# EAGLE design motoko_5_0 (EAGLE 9.5.2)
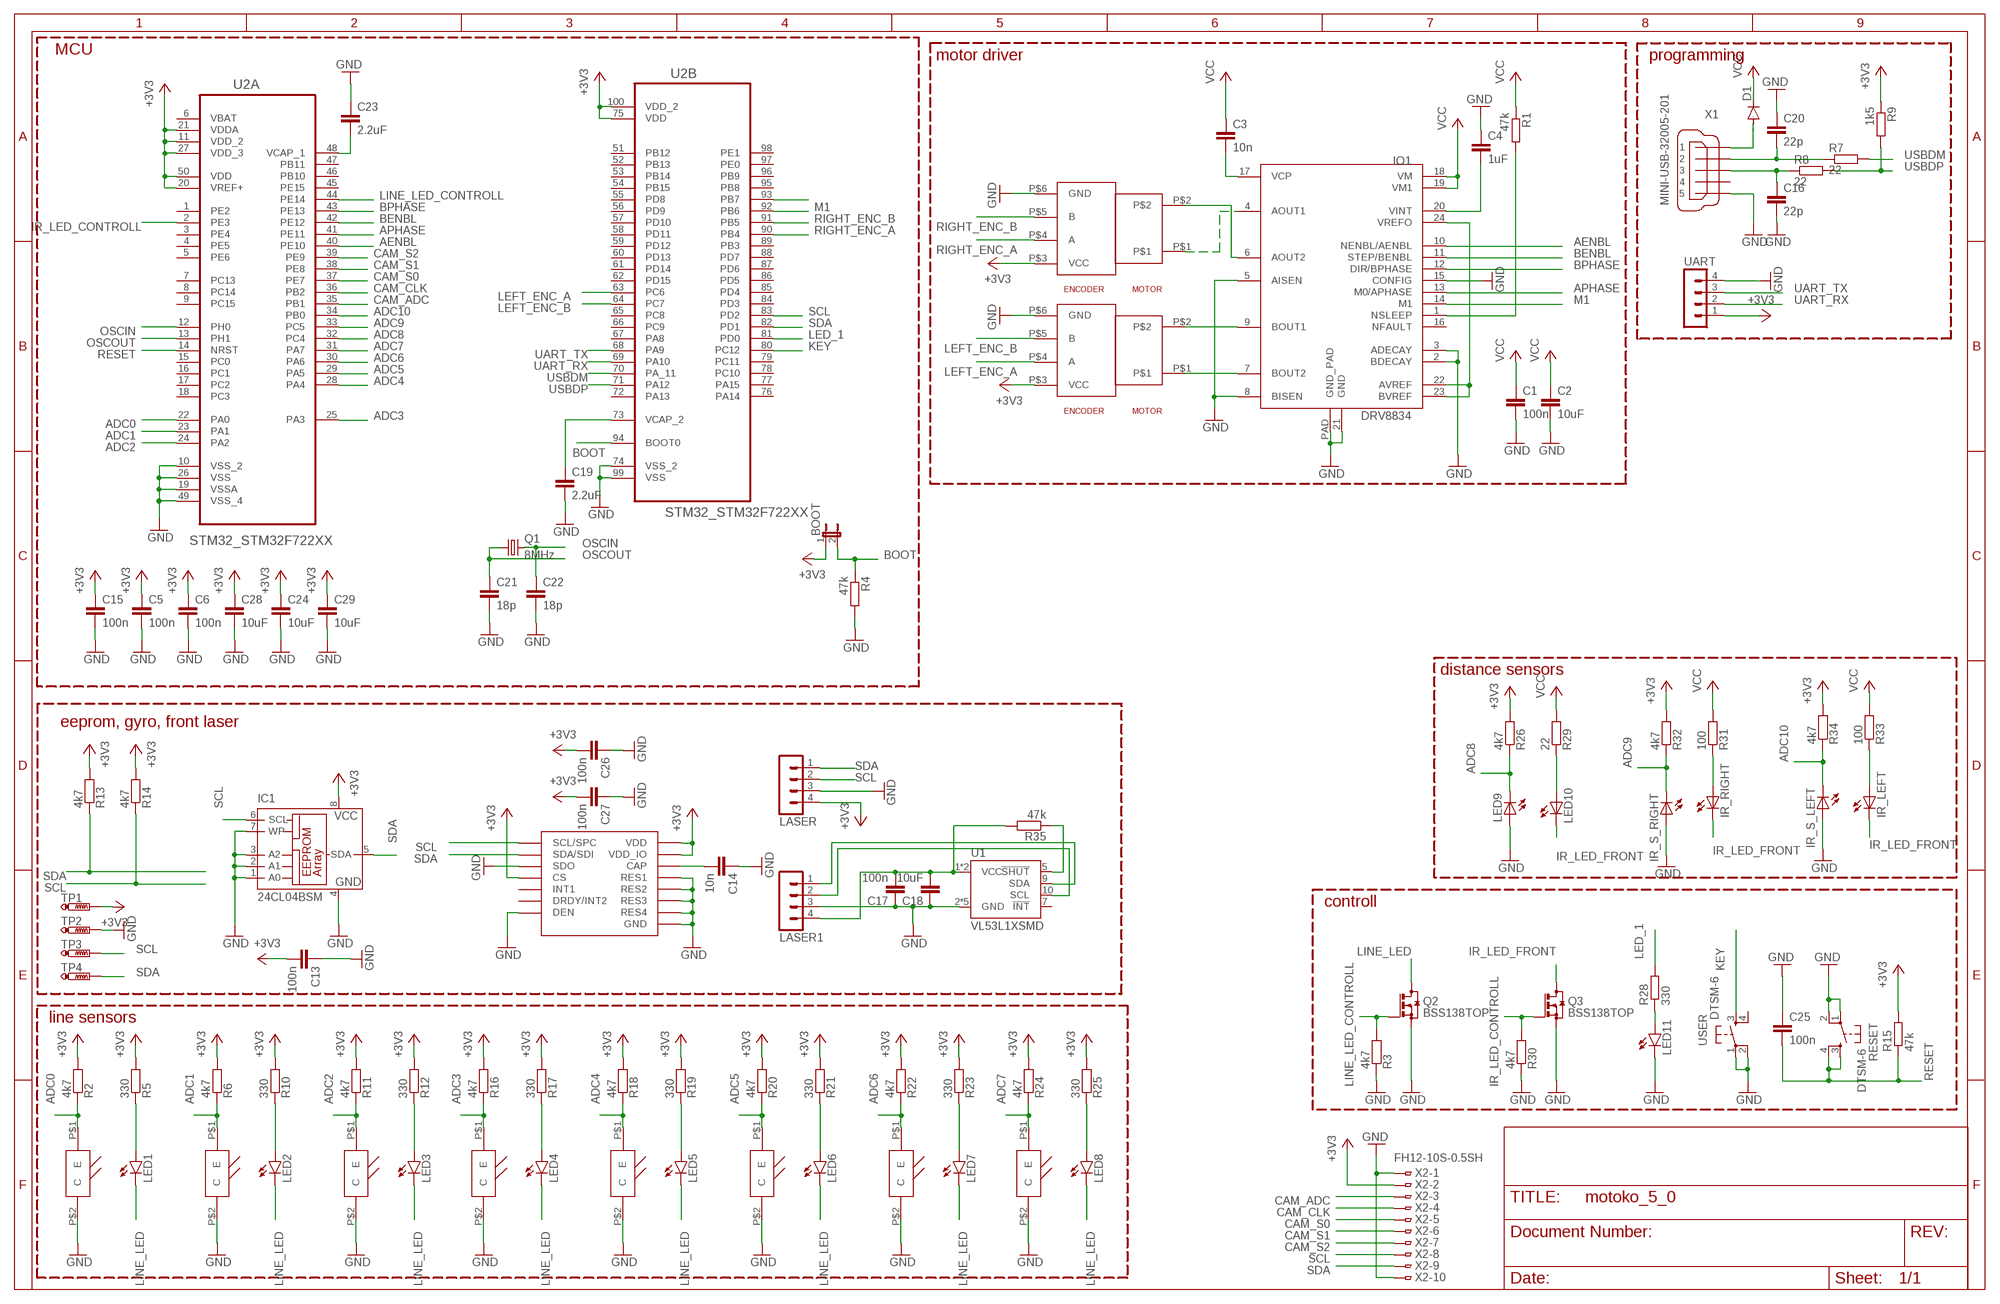
[diagram p0: schematic, sheet 1, part 1 of 2]
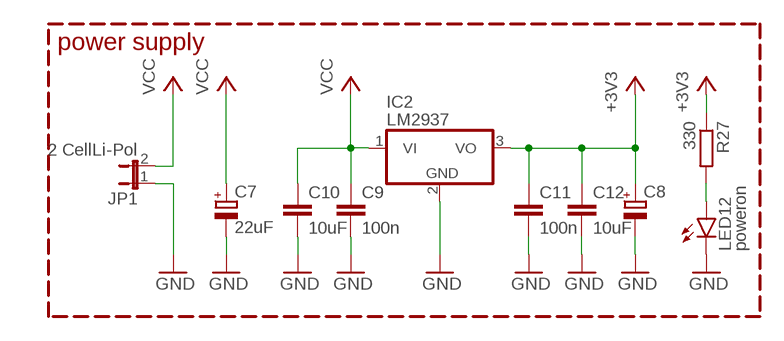
[diagram p1: schematic, sheet 1, part 2 of 2]

## Parts
BOOT  JP1E  [JP1]
C1  100n  C-EUC1206  [C1206]
C2  10uF  C-EUC1206  [C1206]
C3  10n  C-EUC1206  [C1206]
C4  1uF  C-EUC1206  [C1206]
C5  100n  C-EUC0805  [C0805]
C6  100n  C-EUC0805  [C0805]
C7  22uF  CPOL-EU153CLV-0505  [153CLV-0505]
C8  CPOL-EU140CLH-1010  [140CLH-1010]
C9  100n  C-EUC0805  [C0805]
C10  10uF  C-EUC0805  [C0805]
C11  100n  C-EUC0805  [C0805]
C12  10uF  C-EUC0805  [C0805]
C13  100n  C-EUC0805  [C0805]
C14  10n  C-EUC0805  [C0805]
C15  100n  C-EUC0805  [C0805]
C16  22p  C-EUC0805  [C0805]
C17  100n  C-EUC0805  [C0805]
C18  10uF  C-EUC0805  [C0805]
C19  2.2uF  C-EUC0805  [C0805]
C20  22p  C-EUC0805  [C0805]
C21  18p  C-EUC0805  [C0805]
C22  18p  C-EUC0805  [C0805]
C23  2.2uF  C-EUC0805  [C0805]
C24  10uF  C-EUC0805  [C0805]
C25  100n  C-EUC0805  [C0805]
C26  100n  C-EUC0805  [C0805]
C27  100n  C-EUC0805  [C0805]
C28  10uF  C-EUC0805  [C0805]
C29  10uF  C-EUC0805  [C0805]
D1  DIODE-SMB  [SMB]
IC1  24CL04BSM  [SO-08M]
IC2  LM2937  [TO263-3]
IO1  DRV8834  [DRV8834_PCK]
IR_LEFT  LED5MM  [LED5MM]
IR_RIGHT  LED5MM  [LED5MM]
IR_S_LEFT  LED5MM  [LED5MM]
IR_S_RIGHT  LED5MM  [LED5MM]
JP1  2 CellLi-Pol  JP1E  [JP1]
LASER  MA04-1  [MA04-1]
LASER1  MA04-1  [MA04-1]
LED1  LEDCHIPLED_1206  [CHIPLED_1206]
LED2  LEDCHIPLED_1206  [CHIPLED_1206]
LED3  LEDCHIPLED_1206  [CHIPLED_1206]
LED4  LEDCHIPLED_1206  [CHIPLED_1206]
LED5  LEDCHIPLED_1206  [CHIPLED_1206]
LED6  LEDCHIPLED_1206  [CHIPLED_1206]
LED7  LEDCHIPLED_1206  [CHIPLED_1206]
LED8  LEDCHIPLED_1206  [CHIPLED_1206]
LED9  LED5MM  [LED5MM]
LED10  LED5MM  [LED5MM]
LED11  LEDCHIPLED_1206  [CHIPLED_1206]
LED12  poweron  LEDCHIPLED_1206  [CHIPLED_1206]
LSM6DS0  ST_L3GD20H  [ST_LGA16L]
Q1  8MHz  CRYSTALCTS406  [CTS406]
Q2  BSS138TOP  [SOT23]
Q3  BSS138TOP  [SOT23]
R1  47k  R-EU_M1206  [M1206]
R2  4k7  R-EU_M0805  [M0805]
R3  4k7  R-EU_M0805  [M0805]
R4  47k  R-EU_M0805  [M0805]
R5  330  R-EU_M0805  [M0805]
R6  4k7  R-EU_M0805  [M0805]
R7  22  R-EU_M0805  [M0805]
R8  22  R-EU_M0805  [M0805]
R9  1k5  R-EU_M0805  [M0805]
R10  330  R-EU_M0805  [M0805]
R11  4k7  R-EU_M0805  [M0805]
R12  330  R-EU_M0805  [M0805]
R13  4k7  R-EU_M0805  [M0805]
R14  4k7  R-EU_M0805  [M0805]
R15  47k  R-EU_M0805  [M0805]
R16  4k7  R-EU_M0805  [M0805]
R17  330  R-EU_M0805  [M0805]
R18  4k7  R-EU_M0805  [M0805]
R19  330  R-EU_M0805  [M0805]
R20  4k7  R-EU_M0805  [M0805]
R21  330  R-EU_M0805  [M0805]
R22  4k7  R-EU_M0805  [M0805]
R23  330  R-EU_M0805  [M0805]
R24  4k7  R-EU_M0805  [M0805]
R25  330  R-EU_M0805  [M0805]
R26  4k7  R-EU_M0805  [M0805]
R27  330  R-EU_M0805  [M0805]
R28  330  R-EU_M0805  [M0805]
R29  22  R-EU_M0805  [M0805]
R30  4k7  R-EU_M0805  [M0805]
R31  100  R-EU_M0805  [M0805]
R32  4k7  R-EU_M0805  [M0805]
R33  100  R-EU_M0805  [M0805]
R34  4k7  R-EU_M0805  [M0805]
R35  47k  R-EU_M0805  [M0805]
RESET  DTSM-6  [DTSM-6]
TP1  PTR1B1,27  [B1,27]
TP2  PTR1B1,27  [B1,27]
TP3  PTR1B1,27  [B1,27]
TP4  PTR1B1,27  [B1,27]
U1  VL53L1XSMD  [VL53L1X]
U2  STM32_STM32F722XX  [STM32_QFP50P1600X1600X160-100N]
U$3  SFH3710  [SFH3710]
U$4  SFH3710  [SFH3710]
U$5  SFH3710  [SFH3710]
U$6  SFH3710  [SFH3710]
U$7  SFH3710  [SFH3710]
U$8  SFH3710  [SFH3710]
U$9  SFH3710  [SFH3710]
U$10  SFH3710  [SFH3710]
U$11  POLOLU_GEAR_MOTORPOLO  [POLOLU_GEAR_MOTOR]
U$12  POLOLU_GEAR_MOTORPOLO  [POLOLU_GEAR_MOTOR]
UART  MA04-1  [MA04-1]
USER  DTSM-6  [DTSM-6]
X1  MINI-USB-32005-201  [32005-201]
X2  FH12-10S-0.5SH  [FH12-10S-0.5SH]

## Nets
+3V3: BOOT.1 C5.1 C6.1 C8.+ C11.1 C12.1 C13.2 C15.1 C24.1 C26.2 C27.2 C28.1 C29.1 IC1.8(VCC) IC2.3(VO) LASER.4 LSM6DS0.P$1(VDD_IO) LSM6DS0.P$5(CS) LSM6DS0.P$16(VDD) R2.2 R5.2 R6.2 R9.1 R10.2 R11.2 R12.2 R13.2 R14.2 R15.2 R16.2 R17.2 R18.2 R19.2 R20.2 R21.2 R22.2 R23.2 R24.2 R25.2 R26.2 R27.1 R32.2 R34.2 TP1.TP U2.11(A:VDD_2) U2.20(A:VREF+) U2.21(A:VDDA) U2.27(A:VDD_3) U2.50(A:VDD) U2.75(B:VDD) U2.100(B:VDD_2) U$11.P$3(VCC) U$12.P$3(VCC) UART.1 X2.2
ADC0: R2.1 U2.22(A:PA0) U$3.P$1(E)
ADC1: R6.1 U2.23(A:PA1) U$4.P$1(E)
ADC2: R11.1 U2.24(A:PA2) U$5.P$1(E)
ADC3: R16.1 U2.25(A:PA3) U$6.P$1(E)
ADC4: R18.1 U2.28(A:PA4) U$7.P$1(E)
ADC5: R20.1 U2.29(A:PA5) U$8.P$1(E)
ADC6: R22.1 U2.30(A:PA6) U$9.P$1(E)
ADC7: R24.1 U2.31(A:PA7) U$10.P$1(E)
ADC8: LED9.K(C) R26.1 U2.32(A:PC4)
ADC9: IR_S_RIGHT.K(C) R32.1 U2.33(A:PC5)
ADC10: IR_S_LEFT.K(C) R34.1 U2.34(A:PB0)
AENBL: IO1.10(NENBL/AENBL) U2.40(A:PE10)
APHASE: IO1.13(M0/APHASE) U2.41(A:PE11)
BENBL: IO1.11(STEP/BENBL) U2.42(A:PE12)
BOOT: BOOT.2 R4.1 U2.94(B:BOOT0)
BPHASE: IO1.12(DIR/BPHASE) U2.43(A:PE13)
CAM_ADC: U2.35(A:PB1) X2.3
CAM_CLK: U2.36(A:PB2) X2.4
CAM_S0: U2.37(A:PE7) X2.5
CAM_S1: U2.38(A:PE8) X2.6
CAM_S2: U2.39(A:PE9) X2.7
GND: C1.2 C2.2 C4.1 C5.2 C6.2 C7.- C8.- C9.2 C10.2 C11.2 C12.2 C13.1 C14.1 C15.2 C16.2 C17.1 C18.1 C19.2 C20.1 C21.2 C22.2 C23.1 C24.2 C25.1 C26.1 C27.1 C28.2 C29.2 IC1.1(A0) IC1.2(A1) IC1.3(A2) IC1.4(GND) IC1.7(WP) IC2.2(GND) IO1.2(BDECAY) IO1.3(ADECAY) IO1.5(AISEN) IO1.8(BISEN) IO1.15(CONFIG) IO1.21(GND) IO1.PAD(GND_PAD) IR_S_LEFT.A IR_S_RIGHT.A JP1.1 LASER1.3 LASER.3 LED9.A LED11.C LED12.C LSM6DS0.P$4(SDO) LSM6DS0.P$8(DEN) LSM6DS0.P$9(RES1) LSM6DS0.P$10(RES2) LSM6DS0.P$11(RES3) LSM6DS0.P$12(GND) LSM6DS0.P$13(GND) LSM6DS0.P$15(RES4) Q2.2(S) Q3.2(S) R3.1 R4.2 R30.1 RESET.1 RESET.2 TP2.TP U1.2(GND) U1.3(GND) U1.4(GND) U1.6(GND) U1.12(GND) U2.10(A:VSS_2) U2.19(A:VSSA) U2.26(A:VSS) U2.49(A:VSS_4) U2.74(B:VSS_2) U2.99(B:VSS) U$3.P$2(C) U$4.P$2(C) U$5.P$2(C) U$6.P$2(C) U$7.P$2(C) U$8.P$2(C) U$9.P$2(C) U$10.P$2(C) U$11.P$6(GND) U$12.P$6(GND) UART.4 USER.1 USER.2 X1.5 X2.1 X2.10
IR_LED_CONTROLL: Q3.1(G) R30.2 U2.2(A:PE3)
IR_LED_FRONT: IR_LEFT.K(C) IR_RIGHT.K(C) LED10.K(C) Q3.3(D)
KEY: U2.80(B:PC12) USER.3
LED_1: R28.2 U2.81(B:PD0)
LEFT_ENC_A: U2.63(B:PC6) U$11.P$4(A)
LEFT_ENC_B: U2.64(B:PC7) U$11.P$5(B)
LINE_LED: LED1.C LED2.C LED3.C LED4.C LED5.C LED6.C LED7.C LED8.C Q2.3(D)
LINE_LED_CONTROLL: Q2.1(G) R3.2 U2.44(A:PE14)
M1: IO1.14(M1) U2.92(B:PB6)
N$1: IO1.6(AOUT2) U$12.P$2
N$2: IO1.4(AOUT1) U$12.P$1
N$3: IO1.7(BOUT2) U$11.P$1
N$4: IO1.9(BOUT1) U$11.P$2
N$5: C3.2 IO1.17(VCP)
N$6: C14.2 LSM6DS0.P$14(CAP)
N$7: LED10.A R29.1
N$8: IO1.22(AVREF) IO1.23(BVREF) IO1.24(VREFO)
N$9: IO1.1(NSLEEP) R1.2
N$13: IR_LEFT.A R33.1
N$14: LED1.A R5.1
N$15: LED2.A R10.1
N$16: LED3.A R12.1
N$17: LED4.A R17.1
N$18: LED5.A R19.1
N$19: LED6.A R21.1
N$20: LED7.A R23.1
N$21: LED8.A R25.1
N$22: C4.2 IO1.20(VINT)
N$23: LED12.A R27.2
N$24: IR_RIGHT.A R31.1
N$25: C19.1 U2.73(B:VCAP_2)
N$26: C17.2 C18.2 LASER1.4 R35.2 U1.1(VCC) U1.11(VCC)
N$27: LASER1.1 U1.9(SDA)
N$28: LASER1.2 U1.10(SCL)
N$29: R35.1 U1.5(!SHUT)
N$30: C23.2 U2.48(A:VCAP_1)
N$32: U2.93(B:PB7)
N$33: LED11.A R28.1
N$55: C20.2 R7.1 X1.2
N$56: C16.1 R8.1 X1.3
N$57: D1.A X1.1
OSCIN: C22.1 Q1.3 U2.12(A:PH0)
OSCOUT: C21.1 Q1.1 U2.13(A:PH1)
RESET: C25.2 R15.1 RESET.3 RESET.4 U2.14(A:NRST)
RIGHT_ENC_A: U2.90(B:PB4) U$12.P$4(A)
RIGHT_ENC_B: U2.91(B:PB5) U$12.P$5(B)
SCL: IC1.6(SCL) LASER.2 LSM6DS0.P$2(SCL/SPC) R14.1 TP3.TP U2.83(B:PD2) X2.8
SDA: IC1.5(SDA) LASER.1 LSM6DS0.P$3(SDA/SDI) R13.1 TP4.TP U2.82(B:PD1) X2.9
UART_RX: U2.69(B:PA10) UART.2
UART_TX: U2.68(B:PA9) UART.3
USBDM: R7.2 U2.70(B:PA_11)
USBDP: R8.2 R9.2 U2.71(B:PA12)
VCC: C1.1 C2.1 C3.1 C7.+ C9.1 C10.1 D1.C IC2.1(VI) IO1.18(VM) IO1.19(VM1) JP1.2 R1.1 R29.2 R31.2 R33.2
Unconnected: IO1.16(NFAULT) LSM6DS0.P$6(DRDY/INT2) LSM6DS0.P$7(INT1) U1.7(!INT) U2.1(A:PE2) U2.3(A:PE4) U2.4(A:PE5) U2.5(A:PE6) U2.7(A:PC13) U2.8(A:PC14) U2.9(A:PC15) U2.15(A:PC0) U2.16(A:PC1) U2.17(A:PC2) U2.18(A:PC3) U2.45(A:PE15) U2.46(A:PB10) U2.47(A:PB11) U2.51(B:PB12) U2.52(B:PB13) U2.53(B:PB14) U2.54(B:PB15) U2.55(B:PD8) U2.56(B:PD9) U2.57(B:PD10) U2.58(B:PD11) U2.59(B:PD12) U2.60(B:PD13) U2.61(B:PD14) U2.62(B:PD15) U2.65(B:PC8) U2.66(B:PC9) U2.67(B:PA8) U2.72(B:PA13) U2.76(B:PA14) U2.77(B:PA15) U2.78(B:PC10) U2.79(B:PC11) U2.84(B:PD3) U2.85(B:PD4) U2.86(B:PD5) U2.87(B:PD6) U2.88(B:PD7) U2.89(B:PB3) U2.95(B:PB8) U2.96(B:PB9) U2.97(B:PE0) U2.98(B:PE1) USER.4 X1.4

## Notes on the sheet
- MCU
- motor driver | programming
- power supply
- distance sensors
- eeprom, gyro, front laser
- controll
- line sensors

## Power pins joined to a net without a drawn wire
VBAT: U2.6(A:VBAT)

## Library data of the parts
BOOT JP1 = jumper:JP1E: JUMPER
C1-C6 C9-C29 = resistor:C-EU: CAPACITOR, European symbol
C7 = resistor:CPOL-EU: POLARIZED CAPACITOR, European symbol
C8 = rcl:CPOL-EU: POLARIZED CAPACITOR, European symbol; SPICEPREFIX: C
D1 = diode:DIODE-: DIODE
IC1 = microchip:24*: Serial EEPROM I2C; MPN: FM24CL04-S; OC_FARNELL: 1607928; OC_NEWARK: 97H6443
IC2 = linear:LM2937: LM2937-2.5, LM2937-3.3 400mA and 500mA Voltage Regulators Source: http://cache.national.com/ds/LM/LM2937-2.5.pdf
IO1 = yellow_car:DRV8834
IR_LEFT IR_RIGHT IR_S_LEFT IR_S_RIGHT LED9 LED10 = my_parts:LED: LED OSRAM: - CHIPLED LG R971, LG N971, LY N971, LG Q971, LY Q971, LO R971, LY R971 LH N974, LH R974 LS Q976, LO Q976, LY Q976 LO Q996 - Hyper CHIPLED LW Q18S LB Q993, LB Q99A, LB R99A - SideLED LS A670, LO A670, LY A670, LG A670, LP A670 LB A673, LV A673, LT A673, LW A673 LH A674 LY A675 LS A676, LA A676, LO A676, LY A676, LW A676 LS A679, LY A679, LG A679 - Hyper Micro SIDELED® LS Y876, LA Y876, LO Y876, LY Y876 LT Y87S - SmartLED LW L88C, LW L88S LB L89C, LB L89S, LG L890 LS L89K, LO L89K, LY L89K LS L896, LA L896, LO L896, LY L896 - TOPLED LS T670, LO T670, LY T670, LG T670, LP T670 LSG T670, LSP T670, LSY T670, LOP T670, LYG T670 LG T671, LOG T671, LSG T671 LB T673, LV T673, LT T673, LW T673 LH T674 LS T676, LA T676, LO T676, LY T676, LB T676, LH T676, LSB T676, LW T676 LB T67C, LV T67C, LT T67C, LS T67K, LO T67K, LY T67K, LW E67C LS E67B, LA E67B, LO E67B, LY E67B, LB E67C, LV E67C, LT E67C LW T67C LS T679, LY T679, LG T679 LS T770, LO T770, LY T770, LG T770, LP T770 LB T773, LV T773, LT T773, LW T773 LH T774 LS E675, LA E675, LY E675, LS T675 LS T776, LA T776, LO T776, LY T776, LB T776 LHGB T686 LT T68C, LB T68C - Hyper Mini TOPLED® LB M676 - Mini TOPLED Santana® LG M470 LS M47K, LO M47K, LY M47K Source: http://www.osram.convergy.de LUXEON: - LUMILED® LXK2-PW12-R00, LXK2-PW12-S00, LXK2-PW14-U00, LXK2-PW14-V00 LXK2-PM12-R00, LXK2-PM12-S00, LXK2-PM14-U00 LXK2-PE12-Q00, LXK2-PE12-R00, LXK2-PE12-S00, LXK2-PE14-T00, LXK2-PE14-U00 LXK2-PB12-K00, LXK2-PB12-L00, LXK2-PB12-M00, LXK2-PB14-N00, LXK2-PB14-P00, LXK2-PB14-Q00 LXK2-PR12-L00, LXK2-PR12-M00, LXK2-PR14-Q00, LXK2-PR14-R00 LXK2-PD12-Q00, LXK2-PD12-R00, LXK2-PD12-S00 LXK2-PH12-R00, LXK2-PH12-S00 LXK2-PL12-P00, LXK2-PL12-Q00, LXK2-PL12-R00 Source: www.luxeon.com KINGBRIGHT: KA-3528ASYC Source: www.kingbright.com
LASER LASER1 UART = con-lstb:MA04-1: PIN HEADER; OC_FARNELL: unknown; OC_NEWARK: unknown
LED1-LED8 LED11 LED12 = led:LED: LED OSRAM: - CHIPLED LG R971, LG N971, LY N971, LG Q971, LY Q971, LO R971, LY R971 LH N974, LH R974 LS Q976, LO Q976, LY Q976 LO Q996 - Hyper CHIPLED LW Q18S LB Q993, LB Q99A, LB R99A - SideLED LS A670, LO A670, LY A670, LG A670, LP A670 LB A673, LV A673, LT A673, LW A673 LH A674 LY A675 LS A676, LA A676, LO A676, LY A676, LW A676 LS A679, LY A679, LG A679 - Hyper Micro SIDELED® LS Y876, LA Y876, LO Y876, LY Y876 LT Y87S - SmartLED LW L88C, LW L88S LB L89C, LB L89S, LG L890 LS L89K, LO L89K, LY L89K LS L896, LA L896, LO L896, LY L896 - TOPLED LS T670, LO T670, LY T670, LG T670, LP T670 LSG T670, LSP T670, LSY T670, LOP T670, LYG T670 LG T671, LOG T671, LSG T671 LB T673, LV T673, LT T673, LW T673 LH T674 LS T676, LA T676, LO T676, LY T676, LB T676, LH T676, LSB T676, LW T676 LB T67C, LV T67C, LT T67C, LS T67K, LO T67K, LY T67K, LW E67C LS E67B, LA E67B, LO E67B, LY E67B, LB E67C, LV E67C, LT E67C LW T67C LS T679, LY T679, LG T679 LS T770, LO T770, LY T770, LG T770, LP T770 LB T773, LV T773, LT T773, LW T773 LH T774 LS E675, LA E675, LY E675, LS T675 LS T776, LA T776, LO T776, LY T776, LB T776 LHGB T686 LT T68C, LB T68C - Hyper Mini TOPLED® LB M676 - Mini TOPLED Santana® LG M470 LS M47K, LO M47K, LY M47K Source: http://www.osram.convergy.de LUXEON: - LUMILED® LXK2-PW12-R00, LXK2-PW12-S00, LXK2-PW14-U00, LXK2-PW14-V00 LXK2-PM12-R00, LXK2-PM12-S00, LXK2-PM14-U00 LXK2-PE12-Q00, LXK2-PE12-R00, LXK2-PE12-S00, LXK2-PE14-T00, LXK2-PE14-U00 LXK2-PB12-K00, LXK2-PB12-L00, LXK2-PB12-M00, LXK2-PB14-N00, LXK2-PB14-P00, LXK2-PB14-Q00 LXK2-PR12-L00, LXK2-PR12-M00, LXK2-PR14-Q00, LXK2-PR14-R00 LXK2-PD12-Q00, LXK2-PD12-R00, LXK2-PD12-S00 LXK2-PH12-R00, LXK2-PH12-S00 LXK2-PL12-P00, LXK2-PL12-Q00, LXK2-PL12-R00 Source: www.luxeon.com KINGBRIGHT: KA-3528ASYC Source: www.kingbright.com
LSM6DS0 = motoko_5_0:ST_L3GD20H
Q1 = crystal:CRYSTAL: CRYSTAL; OC_FARNELL: unknown; OC_NEWARK: unknown
Q2 Q3 = JCM:BSS138
R1-R35 = resistor:R-EU_: RESISTOR, European symbol
RESET USER = switch-tact:DTSM-6
TP1-TP4 = testpad:PTR1: TEST PIN
U1 = SparkFun-Sensors:VL53L1X: STMicroelectronics VL53L1X - 400 cm IR Laser ToF Sensor VL53L1X is a state-of-the-art ToF laser-ranging sensor, enhancing the ST FlightSense product family. It is the fastest miniature ToF sensor currently on the market with accurate ranging up to 4 m and fast ranging frequency (up to 50 Hz). Housed in a miniature and reflowable package, it integrates a single photon avalanche diode (SPAD) receiving array, a 940 nm invisible laser Class 1 emitter, physical infrared filters, and optics to achieve the best ranging performance in various ambient lighting conditions with a range of cover window options.; PROD_ID: IC-13960
U2 = ascender_board:STM32_STM32F722XX: IC, MCU, 32BIT, 512K FLASH, 100LQFP; MPN: STM32F407VET6; OC_FARNELL: 2064367; OC_NEWARK: 73T2332; PACKAGE: 100LQFP; SUPPLIER: STMicroelectronics
U$3-U$10 = my_parts:SFH3710
U$11 U$12 = my_parts:POLOLU_GEAR_MOTOR
X1 = con-cypressindustries:MINI-USB-: MINI USB-B Conector Source: www.cypressindustries.com; OC_FARNELL: unknown; OC_NEWARK: unknown
X2 = con-hirose:FH12-10S-0.5S: 0.5mm Pitch Connectors For FPC/FFC Source: Data sheet <http://www.hirose.co.jp/cataloge_hp/e58605370.pdf>; MPN: FH12-10S-0.5SH(55); OC_FARNELL: 1324540; OC_NEWARK: 34M6152

## Board
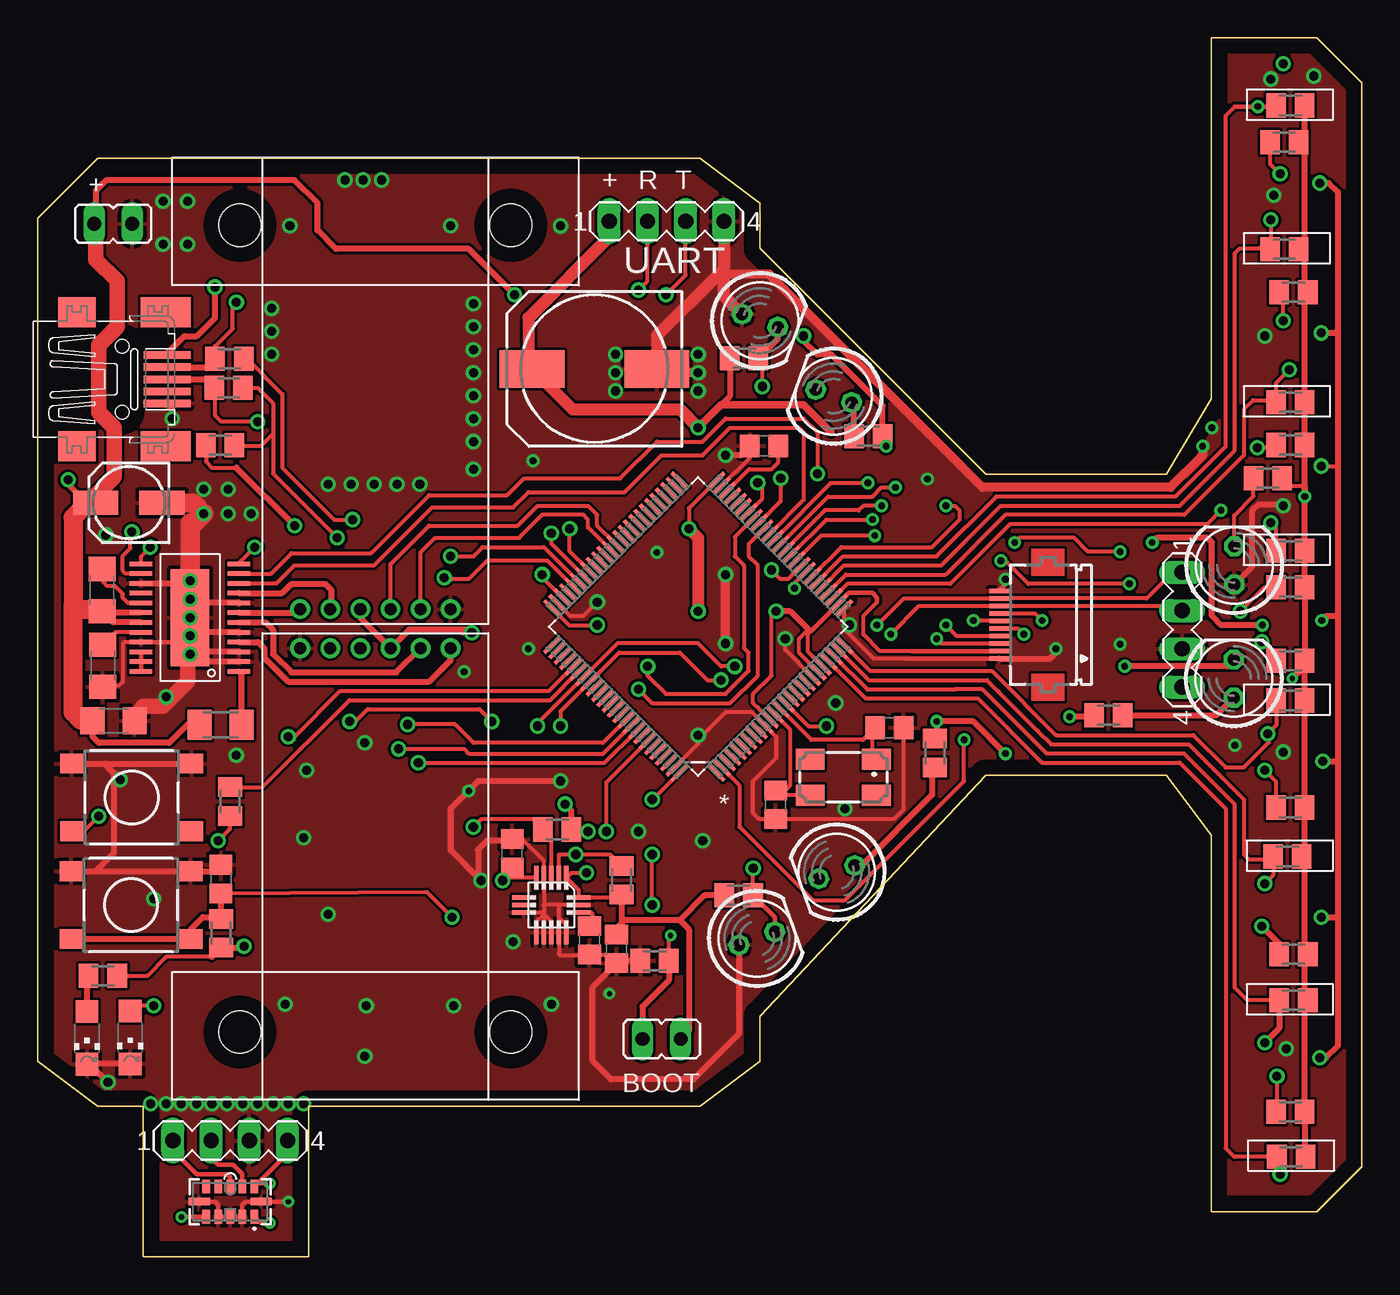
[diagram p2: board, top side]
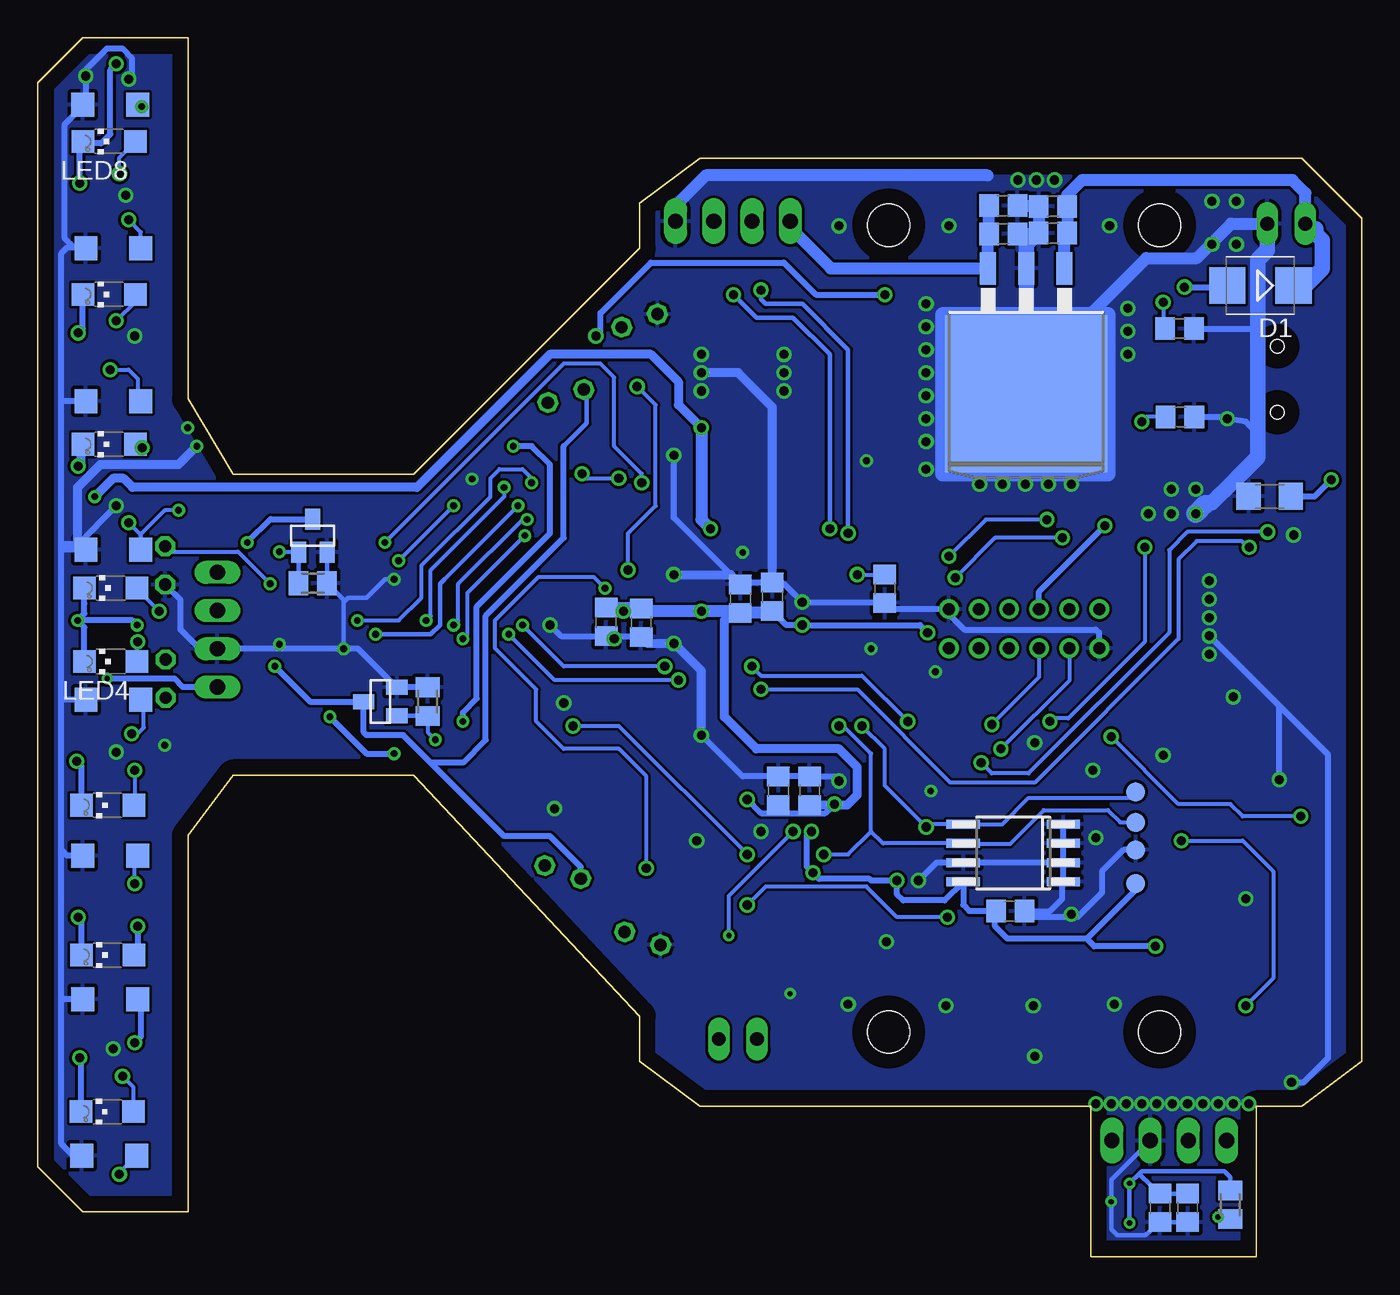
[diagram p3: board, bottom side, seen from below]

Size 88 x 81 mm. Coordinates in mm from the lower left corner, seen from the top.
Outline: 85,81 78,81 78,57 75,52 63,52 48,67 48,70 44,73 4,73 0,69 0,13 4,10 7,10 7,0 18,0 18,10 44,10 48,13 48,16 63,32 75,32 78,28 78,3 85,3 88,6 88,78 85,81
Copper layers (1*16): Top 0.035mm / dielectric 1.5mm / Bottom 0.035mm
Design rules "default *": minimum track width 8mil, minimum drill 24mil, track to track 7mil, track to pad 7mil, pad to pad 7mil, via to via 7mil, smd to smd 7mil, copper to edge 40mil, drill to drill 8mil, minimum pad ring 10mil, minimum via ring 8mil, stop-mask expansion 4mil, vias tented up to drill 30mil, thermal gap 10mil

### Footprints (pad centres in the part's own frame; a part is rotated, then mirrored left to right if it is on the bottom)
JP1 = drill 0.914 long: 1 0,-1.27; 2 0,1.27
C1206 = smd 1.6 x 1.8: 1 -1.4,0; 2 1.4,0
C0805 = smd 1.3 x 1.5: 1 -0.95,0; 2 0.95,0
153CLV-0505 = smd 3 x 1.6: + 2.2,0; - -2.2,0
140CLH-1010 = smd 4.3 x 2.5: + 4.15,0; - -4.15,0
SMB = smd 2.4 x 2.4: A 2.2,0; C -2.2,0
SO-08M = smd 0.6 x 2.2: 1 -1.905,-3.33; 2 -0.635,-3.33; 3 0.635,-3.33; 4 1.905,-3.33; 5 1.905,3.33; 6 0.635,3.33; 7 -0.635,3.33; 8 -1.905,3.33
TO263-3 = smd 1.067 x 2.159: 1 -2.54,-5.791; 2 0,-5.791; 3 2.54,-5.791 | smd 10.8 x 10.41: TAB 0,2.54
DRV8834_PCK = smd 0.3 x 1.5: 1 -3.575,-3.25; 2 -2.925,-3.25; 3 -2.275,-3.25; 4 -1.625,-3.25; 5 -0.975,-3.25; 6 -0.325,-3.25; 7 0.325,-3.25; 8 0.975,-3.25; 9 1.625,-3.25; 10 2.275,-3.25; 11 2.925,-3.25; 12 3.575,-3.25; 13 3.575,3.25; 14 2.925,3.25; 15 2.275,3.25; 16 1.625,3.25; 17 0.975,3.25; 18 0.325,3.25; 19 -0.325,3.25; 20 -0.975,3.25; 21 -1.625,3.25; 22 -2.275,3.25; 23 -2.925,3.25; 24 -3.575,3.25 | smd 6.452 x 2.54: PAD 0,0
LED5MM = drill 0.813 octagon: A -1.27,0; K 1.27,0
MA04-1 = drill 1.016 long: 1 -3.81,0; 2 -1.27,0; 3 1.27,0; 4 3.81,0
CHIPLED_1206 = smd 1.5 x 1.5: A 0,-1.75; C 0,1.75
ST_LGA16L = smd 1.6 x 0.3: P$1 -1.8,1; P$2 -1.8,0.5; P$3 -1.8,0; P$4 -1.8,-0.5; P$5 -1.8,-1; P$9 1.8,-1; P$10 1.8,-0.5; P$11 1.8,0; P$12 1.8,0.5; P$13 1.8,1 | smd 0.3 x 1.6: P$6 -0.5,-1.8; P$7 0,-1.8; P$8 0.5,-1.8; P$14 0.5,1.8; P$15 0,1.8; P$16 -0.5,1.8
CTS406 = smd 1.9 x 1.4: 1 -2.2,-1.2; 2 2.2,-1.2; 3 2.2,1.2; 4 -2.2,1.2
SOT23 = smd 1 x 1.4: 1 -0.95,-1.1; 2 0.95,-1.1; 3 0,1.1
M1206 = smd 1.6 x 2: 1 -1.4,0; 2 1.4,0
M0805 = smd 1.3 x 1.6: 1 -0.95,0; 2 0.95,0
DTSM-6 = smd 1.55 x 1.3: 1 -3.975,2.25; 2 3.975,2.25; 3 -3.975,-2.25; 4 3.975,-2.25
B1,27 = smd 1.27 x 1.27: TP 0,0
VL53L1X = smd 0.5 x 0.9: 1 1.6,-1; 2 0.8,-1; 3 0,-1; 4 -0.8,-1; 5 -1.6,-1; 7 -1.6,1; 8 -0.8,1; 9 0,1; 10 0.8,1; 11 1.6,1 | smd 1.4 x 0.5: 6 -2.05,0; 12 2.05,0
STM32_QFP50P1600X1600X160-100N = smd 1.473 x 0.254: 1 -7.722,5.994; 2 -7.722,5.512; 3 -7.722,5.004; 4 -7.722,4.496; 5 -7.722,3.988; 6 -7.722,3.505; 7 -7.722,2.997; 8 -7.722,2.489; 9 -7.722,2.007; 10 -7.722,1.499; 11 -7.722,0.991; 12 -7.722,0.508; 13 -7.722,0; 14 -7.722,-0.508; 15 -7.722,-0.991; 16 -7.722,-1.499; 17 -7.722,-2.007; 18 -7.722,-2.489; 19 -7.722,-2.997; 20 -7.722,-3.505; 21 -7.722,-3.988; 22 -7.722,-4.496; 23 -7.722,-5.004; 24 -7.722,-5.512; 25 -7.722,-5.994; 51 7.722,-5.994; 52 7.722,-5.512; 53 7.722,-5.004; 54 7.722,-4.496; 55 7.722,-3.988; 56 7.722,-3.505; 57 7.722,-2.997; 58 7.722,-2.489; 59 7.722,-2.007; 60 7.722,-1.499; 61 7.722,-0.991; 62 7.722,-0.508; 63 7.722,0; 64 7.722,0.508; 65 7.722,0.991; 66 7.722,1.499; 67 7.722,2.007; 68 7.722,2.489; 69 7.722,2.997; 70 7.722,3.505; 71 7.722,3.988; 72 7.722,4.496; 73 7.722,5.004; 74 7.722,5.512; 75 7.722,5.994 | smd 0.254 x 1.473: 26 -5.994,-7.722; 27 -5.512,-7.722; 28 -5.004,-7.722; 29 -4.496,-7.722; 30 -3.988,-7.722; 31 -3.505,-7.722; 32 -2.997,-7.722; 33 -2.489,-7.722; 34 -2.007,-7.722; 35 -1.499,-7.722; 36 -0.991,-7.722; 37 -0.508,-7.722; 38 0,-7.722; 39 0.508,-7.722; 40 0.991,-7.722; 41 1.499,-7.722; 42 2.007,-7.722; 43 2.489,-7.722; 44 2.997,-7.722; 45 3.505,-7.722; 46 3.988,-7.722; 47 4.496,-7.722; 48 5.004,-7.722; 49 5.512,-7.722; 50 5.994,-7.722; 76 5.994,7.722; 77 5.512,7.722; 78 5.004,7.722; 79 4.496,7.722; 80 3.988,7.722; 81 3.505,7.722; 82 2.997,7.722; 83 2.489,7.722; 84 2.007,7.722; 85 1.499,7.722; 86 0.991,7.722; 87 0.508,7.722; 88 0,7.722; 89 -0.508,7.722; 90 -0.991,7.722; 91 -1.499,7.722; 92 -2.007,7.722; 93 -2.489,7.722; 94 -2.997,7.722; 95 -3.505,7.722; 96 -3.988,7.722; 97 -4.496,7.722; 98 -5.004,7.722; 99 -5.512,7.722; 100 -5.994,7.722
SFH3710 = smd 1.52 x 1.6: P$1 -1.75,0; P$2 1.9,0
POLOLU_GEAR_MOTOR = drill 0.8: P$1 -5,-14.5; P$2 -3,-14.5; P$3 -1,-14.5; P$4 1,-14.5; P$5 3,-14.5; P$6 5,-14.5 | hole 2.8: -9,11; 9,11
32005-201 = smd 3.1 x 0.5: 1 3,1.6; 2 3,0.8; 3 3,0; 4 3,-0.8; 5 3,-1.6 | smd 2.5 x 2: M1 -3,-4.45; M2 -3,4.45 | smd 3.3 x 2: M3 2.9,4.45; M4 2.9,-4.45 | hole 0.9: 0,2.2; 0,-2.2
FH12-10S-0.5SH = smd 0.3 x 1.3: 1 -2.25,3.25; 2 -1.75,3.25; 3 -1.25,3.25; 4 -0.75,3.25; 5 -0.25,3.25; 6 0.25,3.25; 7 0.75,3.25; 8 1.25,3.25; 9 1.75,3.25; 10 2.25,3.25

### Placement (x,y rotation side)
BOOT  41.46,14.48 90 top
C1  6.13,50.52 180 bottom
C2  5.05,35.62 0 top
C3  4.29,44.3 90 top
C4  4.34,39.27 90 top
C5  50.22,42.19 270 bottom
C6  38.78,30.97 90 bottom
C7  6.06,50.09 180 top
C8  37,59 180 top
C9  20.53,68.02 180 bottom
C10  20.53,69.79 180 bottom
C11  23.83,69.84 0 bottom
C12  23.83,67.96 0 bottom
C13  23.37,22.98 180 bottom
C14  36.68,21.05 90 top
C15  39.17,43.85 90 bottom
C16  12.08,55.8 0 bottom
C17  13.41,3.27 90 bottom
C18  11.58,3.27 90 bottom
C19  31.7,44.39 270 bottom
C20  12.12,61.68 180 bottom
C21  56.59,35.16 0 top
C22  49.04,30.04 270 top
C23  48.27,53.88 0 top
C24  47.89,42.14 270 bottom
C25  12.19,25.11 270 top
C26  38.47,20.47 90 top
C27  31.53,26.81 270 top
C28  36.7,30.98 90 bottom
C29  41.3,43.73 90 bottom
D1  6.74,64.53 180 bottom
IC1  23.16,26.84 90 bottom
IC2  22.31,59.89 180 bottom
IO1  10.13,42.47 90 top
IR_LEFT  53.1,25.57 200 top
IR_RIGHT  52.9,57.18 160 top
IR_S_LEFT  48,62.2 340 top
IR_S_RIGHT  47.8,21.16 20 top
JP1  5.02,68.64 90 top
LASER  76.06,41.67 270 top
LASER1  12.8,7.74 0 top
LED1  83.37,9.65 90 bottom
LED2  83.35,20.05 90 bottom
LED3  83.35,30.01 90 bottom
LED4  83.14,39.56 90 bottom
LED5  83.14,44.44 90 bottom
LED6  83.25,53.99 90 bottom
LED7  83.25,63.94 90 bottom
LED8  83.25,74.1 90 bottom
LED9  79.52,45.94 90 top
LED10  79.49,38.42 90 top
LED11  6.15,14.58 180 top
LED12  3.28,14.55 180 top
LSM6DS0  34.14,23.38 270 top
Q1  53.54,31.87 180 top
Q2  69.72,47.92 0 bottom
Q3  65.23,36.9 90 bottom
R1  12.16,35.36 0 top
R2  83.3,6.65 0 top
R3  69.72,44.75 180 bottom
R4  41,19.68 180 top
R5  83.25,9.64 0 top
R6  83.46,17.06 0 top
R7  12.75,59.66 0 top
R8  12.7,57.73 0 top
R9  12.14,53.91 0 top
R10  83.46,20.1 0 top
R11  83.05,26.61 0 top
R12  83.25,29.86 0 top
R13  34.52,28.4 0 top
R14  38.8,25.03 270 top
R15  12.2,21.51 270 top
R16  83.25,36.97 0 top
R17  83.25,39.61 0 top
R18  83.25,46.93 0 top
R19  83.25,44.49 0 top
R20  83.25,56.78 0 top
R21  83.25,53.94 0 top
R22  82.85,66.94 0 top
R23  83.46,64.1 0 top
R24  83.25,76.49 0 top
R25  82.85,74.05 0 top
R26  81.75,51.73 0 top
R27  4.34,18.69 180 top
R28  12.78,30.26 90 top
R29  71.16,35.98 180 top
R30  62.08,36.9 270 bottom
R31  55.2,54.53 0 top
R32  46.59,24.02 180 top
R33  59.62,33.48 90 top
R34  46.94,59.71 180 top
R35  8.74,3.47 90 bottom
RESET  6.2,23.38 0 top
TP1  15.04,24.81 0 bottom
TP2  15.04,27.04 0 bottom
TP3  15.04,28.87 0 bottom
TP4  15.04,30.9 0 bottom
U1  12.8,3.67 0 top
U2  43.89,41.88 135 top
U$3  83.17,6.73 180 bottom
U$4  83.09,17.11 180 bottom
U$5  83.09,26.66 180 bottom
U$6  82.89,37.03 180 bottom
U$7  82.89,46.98 180 bottom
U$8  82.89,56.84 180 bottom
U$9  82.89,67 180 bottom
U$10  83.09,76.55 180 bottom
U$11  22.45,57.54 0 top
U$12  22.45,25.94 180 top
UART  41.8,68.8 0 top
USER  6.25,30.53 0 top
X1  5.61,58.31 0 top
X2  67.13,42 90 top

### Tracks (layer width: path | path; a pad name or v marks a point on that pad's centre or on a via)
+3V3  (via drill 0.35, 0.45, 0.6, 0.61)
  Top 0.254: R27.1 7.3,18.69 8.53,19.93 11.57,19.93 | R9.1 11.19,52.84 11.58,52.44 13.21,52.44 | R25.2 83.93,74.05 84.2,73.78 | R24.2 84.2,76.23 84.19,76.22 | 82.7,51.22 84.2,51.22 | LSM6DS0.P$1 35.14,24.99 | U2.100 40.89,30.39 v40.84,30.39 | U2.75 35.31,41.98 v37.19,41.98 | U2.50 43.28,49.74 v43.28,48.38 | U2.21 51.21,40.2 51.21,41.4 51.34,41.53 51.5,41.69 | 51.5,41.69 U2.27 | U2.20 50.6,40.13 50.6,41.06 51.22,41.69 51.5,41.69 | 58.12,40.25 55.98,40.25 54.86,41.37 54.86,42.59 55.78,43.5 | U2.11 48.02,36.35 | 48.02,36.35 47.88,36.49 47.85,36.49 | 48.02,36.35 47.99,36.35 47.55,36.8 47.55,37.41 48.77,38.62 48.77,42.59 v49.07,42.89 | LSM6DS0.P$1 35.94,24.38 LSM6DS0.P$16 38.6,23.88 R14.2 | LSM6DS0.P$1 35.47,25.52 v36.47,25.52 | R13.2 35.61,28.26 | LSM6DS0.P$5 31.06,25.18 v30.89,25.01 30.95,24.94
  Top 0.305: 38.51,21.55 C26.2 | X2.2 58.12,40.25 | 55.78,43.5 55.78,43.81 55.47,44.11 53.92,44.11 51.34,41.53 | 82.7,51.22 R26.2
  Top 0.406: U$11.P$3 21.45,42.44 U$12.P$3 24.68,41.67 28.04,41.67 | 28.45,41.67 28.04,41.67 | v17.07,48.58 13.21,52.44 | v28.85,41.47 28.25,41.47 28.04,41.67 | R2.2 84.25,9.6 R5.2 84.2,17.09 | 84.2,17.09 84.2,19.73 | 84.2,19.73 84.2,26.64 | 84.2,26.64 R12.2 R16.2 R17.2 | v84.2,50.51 R18.2 R19.2 R17.2 | 84.2,51.22 v84.2,50.51 | v84.2,50.51 R21.2 R20.2 84.2,64.63 | R11.2 84.17,26.61 84.2,26.64 | R10.2 84.41,19.93 84.2,19.73 | R6.2 84.23,17.06 84.2,17.09 | 84.2,64.63 84.2,67.07 | 84.2,67.07 84.2,73.78 R24.2 83.99,76.71 | R22.2 84.07,66.94 84.2,67.07 | R23.2 84.41,64.43 84.2,64.63 | 84.19,76.22 84.19,76.83 | R13.2 35.47,29.67 v35.05,30.09 | 39.09,24.2 R14.2 38.8,21.85 38.51,21.55 | C26.2 38.2,21.38 38.2,21.55 39.01,22.37 42.67,22.37 | v83.38,38.42 84.2,39.25 R17.2 | 42.67,22.37 43.28,21.76 43.28,15.02 BOOT.1 | R32.2 44.32,24.02 42.67,22.37 | R34.2 45.99,57.19 v43.89,55.08 | 51.22,41.69 50.02,42.89 v49.07,42.89 | 11.57,19.93 R15.2 13.63,20.56 v13.72,20.64 | 35.61,28.26 v36.58,28.26 | C27.2 30.89,25.21 v30.89,25.01
  Top 0.508: v43.89,55.08 45.41,56.61 50.9,56.61 52.73,54.78
  Top 0.813: UART.1 37.98,67.77 32.61,62.4 32.61,59.24 C8.+ 35.55,56.3 42.67,56.3 v43.89,55.08 | v43.28,48.38 43.89,47.77 v43.89,42.89
  Bottom 0.254: C6.1 38.77,29.55 38.71,29.48 | C28.1 36.7,29.9 36.27,29.48
  Bottom 0.406: U$11.P$3 21.45,44.2 v17.07,48.58 | TP1.TP 15.04,24.4 18.29,21.15 | 18.29,21.15 23.57,21.15 24.38,21.96 24.38,22.81 C13.2 26.09,22.98 26.5,23.38 IC1.8 27.74,23.69 30.48,23.69 30.89,24.09 v30.89,25.01 32.61,25.01 32.71,25.11 36.07,25.11 v36.47,25.52 36.88,25.92 36.88,27.96 v36.58,28.26 | LASER.4 78.35,37.86 78.91,38.42 v83.38,38.42 | v40.84,30.39 39.93,29.48 38.71,29.48 36.27,29.48 35.66,29.48 v35.05,30.09 | 39.29,42.78 C15.1 38.25,41.98 v37.19,41.98 29.36,41.98 v28.85,41.47 | 43.78,42.78 v43.89,42.89 44.09,43.09 | C24.1 47.55,43.09 47.6,43.14 | v49.07,42.89 49.07,43.09 | v13.72,20.64 17.78,20.64 18.29,21.15
  Bottom 0.61: C28.1 34.2,30.03 33.53,30.7 33.53,32.53 34.75,33.75 40.23,33.75 42.37,35.88 42.37,42.28 41.76,42.89 | v43.89,55.08 45.41,56.61 45.41,58.13 47.24,59.96 53.95,59.96 62.79,51.12 81.69,51.12 82.3,51.73 82.98,51.73 v84.2,50.51
  Bottom 0.813: C11.1 C12.1 24.85,67.8 IC2.3 35.28,65.68 37.98,68.38 UART.1 | 39.29,42.78 C29.1 41.41,42.89 41.76,42.89 v43.89,42.89 47.7,42.89 C24.1 49.07,43.09 50.16,43.09 C5.1 | v43.89,55.08 43.89,48.99 v43.28,48.38
ADC0  (via drill 0.6)
  Top 0.254: v82.56,5.49 82.56,6.43 R2.1 79.53,6.65 78.94,7.23 78.94,29.79 75.89,32.83 66.75,32.83 62.48,37.1 55.02,37.1 U2.22
  Bottom 0.254: v82.56,5.49 82.56,5.59 U$3.P$1
ADC1  (via drill 0.6)
  Top 0.254: 82.51,16.62 R6.1 80.39,17.06 79.55,17.9 79.55,30.09 76.2,33.44 67.06,33.44 62.79,37.71 60.96,37.71 60.66,37.71 55.13,37.71 U2.23
  Top 0.406: 82.51,16.62 82.51,15.2 v81.55,14.24
  Bottom 0.254: 81.14,16.91 U$4.P$1
  Bottom 0.406: 81.14,16.91 81.14,14.65 v81.55,14.24
ADC2  (via drill 0.6)
  Top 0.254: v81.55,24.81 82.1,25.36 R11.1 81.92,26.43 80.47,26.43 80.16,26.74 80.16,30.39 76.5,34.05 67.36,34.05 66.45,34.97 63.86,37.56 63.09,38.32 55.24,38.32 U2.24
  Bottom 0.254: v81.55,24.81 81.55,26.46 U$5.P$1
ADC3  (via drill 0.6)
  Top 0.254: R16.1 82.3,35.32 81.82,34.83 | 81.82,34.83 v81.75,34.76 | U2.25 55.31,38.93 63.4,38.93 67.67,34.66 76.81,34.66 78.94,32.53 80.16,32.53 81.82,34.19 81.82,34.83
  Bottom 0.254: U$6.P$1 80.94,36.83 80.94,35.17 81.34,34.76 v81.75,34.76
ADC4  (via drill 0.45, 0.6)
  Top 0.254: R18.1 82.3,48.44 v81.95,48.78 | U2.28 53.81,44.72 60.66,44.72 64.62,48.68 77.72,48.68 v78.64,49.6
  Bottom 0.254: U$7.P$1 | U$7.P$1 81.14,47.97 v81.95,48.78 | v78.64,49.6 79.55,49.6 81.14,48.01 U$7.P$1
ADC5  (via drill 0.6)
  Top 0.254: R20.1 82.3,56.91 | 82.3,56.91 82.3,58.07 v83.17,58.94 | U2.29 53.7,45.33 60.35,45.33 64.31,49.29 76.2,49.29 80.16,53.25 80.16,56.3 80.77,56.91 82.3,56.91
  Top 0.305: 82.03,56.51 R20.1
  Bottom 0.254: v83.17,58.94 81.95,58.94 81.34,58.33 81.34,57.04 U$8.P$1
ADC6  (via drill 0.6)
  Top 0.254: v81.95,68.9 81.95,67 | 81.95,67 R22.1 81.82,66.87 | U2.30 53.59,45.94 60.05,45.94 64.01,49.9 75.89,49.9 79.55,53.56 79.55,66.67 79.89,67 81.95,67
  Top 0.305: U$9.P$1 81.84,67 R22.1
  Bottom 0.254: U$9.P$1 81.14,68.09 v81.95,68.9
ADC7  (via drill 0.45)
  Top 0.254: R24.1 82.3,76.88 | U2.31 53.52,46.55 59.74,46.55 63.7,50.51 75.59,50.51 78.94,53.86 78.94,75.81 79.55,76.42
  Top 0.305: 82.23,76.42 v81.08,76.42 79.55,76.42
  Top 0.406: 82.23,76.42 R24.1
  Bottom 0.254: 81.14,76.42 81.14,76.75 U$10.P$1 | 81.55,76.75 U$10.P$1 | 80.94,76.95 U$10.P$1
  Bottom 0.305: U$10.P$1 81.21,76.55 v81.08,76.42
ADC8  (via drill 0.45)
  Top 0.254: U2.32 53.41,47.16 59.44,47.16 61.27,48.99 61.27,49.6 60.96,49.9 v60.35,49.9 | LED9.K 79.52,49.25 80.8,50.54 R26.1 | v72.54,44.72 65.84,44.72 64.31,46.24 v64.01,46.24
  Bottom 0.254: LED9.K 79.16,46.85 74.68,46.85 v72.54,44.72 | v64.01,46.24 v60.35,49.9
ADC9  (via drill 0.45, 0.61)
  Top 0.254: R32.1 v47.54,25.81 v47.55,25.82 | U2.33 50.29,44.76 v50.29,44.41
  Top 0.305: IR_S_RIGHT.K 48.99,22.57 R32.1
  Bottom 0.254: v50.29,44.41 51.05,45.18 54.71,45.18 57.61,42.28 57.61,40.45 54.86,37.71 54.86,35.58 53.03,33.75 49.38,33.75 47.55,31.92 v47.55,25.82
ADC10  (via drill 0.61)
  Top 0.254: v48.16,57.83 48.16,59.44 R34.1 | U2.34 49.88,45.02 49.38,45.02 v48.77,45.63
  Top 0.406: R34.1 49.2,61.01 IR_S_LEFT.K
  Bottom 0.254: v48.77,45.63 48.77,48.07 46.94,49.9 46.94,56.61 v48.16,57.83
AENBL
  Top 0.254: IO1.10 15.88,44.75 17.07,45.94 22.35,45.94 26.21,49.8 31.6,49.8 32.61,50.82 39.01,50.82 41.45,53.25 44.2,53.25 46.02,55.08 50.6,55.08 50.9,54.78 50.9,50.29 U2.40
APHASE  (via drill 0.6, 0.61)
  Top 0.254: IO1.13 6.88,46.54 v7.49,47.15 | U2.41 47.24,47.35 47.24,46.55 47.85,45.94 47.85,38.62 46.02,36.8 40.84,36.8 v39.93,37.71
  Bottom 0.254: v7.49,47.15 7.59,47.15 7.99,47.55 10.98,47.55 12.19,46.35 12.19,41.06 21.74,31.51 27.33,31.51 33.53,37.71 v39.93,37.71
BENBL  (via drill 0.61)
  Top 0.254: IO1.11 15.51,45.4 16.87,46.75 22.15,46.75 26.01,50.61 31.19,50.61 32.31,51.73 38.71,51.73 41.15,54.17 44.2,54.17 45.72,55.69 50.9,55.69 51.82,54.78 v51.82,52.03 | v49.38,51.73 49.38,50.2 U2.42
  Bottom 0.254: v51.82,52.03 51.51,51.73 v49.38,51.73
BOOT  (via drill 0.35, 0.61)
  Top 0.254: 42,19.63 R4.1 | R4.1 41.95,19.93 41.95,21.24 v42.06,21.35 | R4.1 41.95,18.67 | v37.8,28.26 37.8,31.54 U2.94
  Top 0.305: 41.95,18.67 41.95,19.93
  Top 0.406: R4.1 41.95,18.4 40.2,16.64 BOOT.2
  Bottom 0.254: v37.8,28.26 42.06,23.99 v42.06,21.35
BPHASE  (via drill 0.6, 0.61)
  Top 0.254: IO1.12 13.38,46.11 v14.43,47.16 | v20.73,35.58 21.13,35.58 21.95,36.39 29.36,36.39 v30.18,35.58 | U2.43 46.33,47.83 46.33,46.55 46.94,45.94 46.94,40.45 47.24,40.15 47.24,38.93 45.72,37.41 41.76,37.41 40.54,38.62 v40.54,39.23
  Bottom 0.254: v14.43,47.16 14.43,40.86 19.51,35.78 20.52,35.78 v20.73,35.58 | v40.54,39.23 39.93,38.62 33.22,38.62 v30.18,35.58
CAM_ADC  (via drill 0.45)
  Top 0.254: X2.3 60.05,40.75 v59.74,41.06 | v55.63,47.92 52.06,47.92 U2.35
  Bottom 0.254: v59.74,41.06 59.44,41.37 59.44,44.11 v55.63,47.92
CAM_CLK  (via drill 0.45)
  Top 0.254: U2.36 52.4,48.99 v55.47,48.99 | X2.4 61.08,41.25 v60.35,41.98
  Bottom 0.254: v60.35,41.98 60.05,42.28 60.05,44.72 55.78,48.99 v55.47,48.99
CAM_S0  (via drill 0.45)
  Top 0.254: U2.37 52.33,49.6 54.56,49.6 54.86,49.9 v56.08,49.9 | X2.5 65.15,41.75 v65.53,41.37
  Bottom 0.254: 60.96,45.02 v56.08,49.9
  Bottom 0.305: v65.53,41.37 61.87,41.37 61.27,41.98 61.27,44.72 60.96,45.02
CAM_S1  (via drill 0.45)
  Top 0.254: X2.6 62.21,42.25 v62.18,42.28 | U2.38 52.53,50.51 55.47,50.51 56.08,51.12 v57,51.12
  Bottom 0.254: v62.18,42.28 61.87,42.59 61.87,45.63 57,50.51 v57,51.12
CAM_S2  (via drill 0.45)
  Top 0.254: X2.7 66.28,42.75 v66.75,42.28 | v55.17,51.43 52.72,51.43 U2.39
  Bottom 0.254: v66.75,42.28 64.01,42.28 62.48,43.81 62.48,45.94 57.91,50.51 57.91,51.73 57.3,52.34 55.78,52.34 55.17,51.73 v55.17,51.43
GND  (via drill 0.35, 0.45, 0.6, 0.61)
  Top 0.254: 10.17,40.2 10.17,40.08 v10.13,40.03 | v10.13,44.91 v10.13,43.69 IO1.PAD 9.72,42.07 | IO1.21 5.76,40.85 5.66,40.75 5.66,38.21 5.4,37.95 4.42,37.95 C4.1 | 33.64,23.38 LSM6DS0.P$4 33.64,26.32 32.2,27.76 31.7,27.76 | 33.64,23.38 33.64,22.98 | 33.64,22.98 33.64,22.77 | 33.64,22.77 LSM6DS0.P$10 | LSM6DS0.P$15 34.75,23.38 | 34.75,23.38 33.64,23.38 | LSM6DS0.P$8 33.54,22.88 33.64,22.98 | LSM6DS0.P$9 33.14,22.27 33.64,22.77 | LSM6DS0.P$11 34.14,22.27 33.64,22.77 | 34.64,22.57 LSM6DS0.P$12 34.64,20.14 | 34.64,22.57 34.64,23.27 34.75,23.38 | LSM6DS0.P$13 35.12,22.08 34.64,22.57 | U2.99 43.89,34.08 43.89,34.36 | C23.1 47.32,53.1 U2.49 45.72,51.5 | U2.74 35.38,42.59 36.27,42.59 v37.19,43.5 | U2.19 49.68,40.32 v49.68,41.06 | U2.26 53.59,42.34 v53.95,41.98 53.65,41.67 55.57,39.75 57.7,39.75 | C21.2 57.54,29.72 56.91,29.09 C22.2 47.94,29.09 47.55,29.48 47.55,31.61 49.07,33.14 49.07,34.57 U2.10 47.46,36.19 45.72,36.19 43.89,34.36 | v43.89,34.66 43.89,34.36 | 34.75,20.03 36.61,20.03 | 36.61,20.03 C14.1 | C26.1 37.96,20.03 36.61,20.03
  Top 0.305: 9.92,41.86 9.72,42.07 | 10.13,40.85 10.13,40.65 11.22,39.55 | 10.13,40.85 v10.13,41.25 10.13,41.34 10.29,41.5 | 10.03,44.4 10.13,44.3 v10.13,43.69 | 10.13,40.85 | 9.52,40.85 IO1.21 | U1.6 11.79,3.67 12,3.46 U1.4 U1.3 U1.2 13.6,3.46 13.82,3.67 U1.12 v16.66,3.67 | X2.1 57.7,39.75 | X2.10 64.31,44.68 v64.31,45.02
  Top 0.406: 10.13,40.65 9.92,40.85 9.52,40.85 10.17,40.2 IO1.3 | IO1.2 11.43,39.55 10.13,40.85 | IO1.5 10.29,41.5 9.92,41.86 | IO1.15 9.68,44.75 10.03,44.4 | IO1.8 10.29,43.45 10.13,43.29 | v8.94,55.69 8.94,56.38 X1.5 | USER.1 4.47,32.78 | 4.47,32.78 USER.2 | 4.47,32.78 5.08,32.17 5.08,26.84 3.87,25.63 RESET.1 RESET.2 11.86,25.63 C25.1 | 4.47,32.78 4.47,32.73 v5.49,31.72 | LED11.C 3.31,12.83 LED12.C 3.47,12.8 v4.67,11.6 | 38.61,19.28 38.48,19.4 C26.1 36.88,17.93 36.88,13.02 38.1,11.8 43.59,11.8 46.61,14.82 IR_S_RIGHT.A | 38,19.52 38.17,19.52 38.33,19.68 R4.2 | LED9.A 80.73,45.89 80.73,49.6 81.14,50 82.67,50 v82.77,49.9 | v34.75,31.61 29.26,31.61 27.43,29.79 27.43,27.04 v29.46,25.01 | C23.1 46.7,53.25 v45.72,53.25 | X2.1 67.27,39.75 67.67,40.15 v67.67,40.4 | v29.46,25.01 29.57,24.91 | v29.46,25.01 29.26,25.21 29.26,27.04 29.87,27.65 31.42,27.65 C27.1 31.7,27.76
  Top 0.61: v43.89,58.74 42.06,58.74 41.76,59.05 41.2,59.05 C8.- | v45.72,40.76 v45.72,45.33 | v77.42,53.86 77.42,53.25 75.29,51.12 62.79,51.12 48.62,65.29 45.26,65.29
  Top 0.813: UART.4 45.6,65.64 | C8.- 41.15,61.18 45.26,65.29 45.6,65.64 | IR_S_LEFT.A 45.6,63.84 45.6,65.64
  Top 1.016: 9.97,39.88 9.97,38.24 8.33,36.59 7.02,36.59 C2.2
  Top 1.27: 10.13,48.77 v10.13,44.91 | 10.13,43.29 v10.13,43.69 10.13,48.47 v11.04,49.38 10.33,50.09 C7.- | 9.97,39.88 v10.13,40.03
  Bottom 0.254: v17.68,10.18 v16.66,10.18 | v7.52,10.18 v8.53,10.18 | v49.68,41.06 49.81,41.06 49.99,41.24 | 43.59,34.36 v43.89,34.66
  Bottom 0.305: C18.1 C17.1 14.39,1.44 16.26,1.44 16.66,1.85 v16.66,3.67 16.66,5.15 LASER1.3 | v64.31,45.02 64.92,45.02 66.14,43.81 67.36,43.81 67.67,43.5 | 67.67,43.5 v67.67,40.4 | 67.67,43.5 67.67,43.65 R3.1 Q2.2
  Bottom 0.406: C20.1 7.02,61.68 6.91,61.79 | C16.2 9.25,55.8 v8.94,55.69 7.72,55.49 6.91,54.68 6.91,53.14 | v5.49,31.72 5.49,36.61 | 5.49,36.61 v10.13,41.25 | v4.67,11.6 3.86,11.6 2.23,13.22 2.23,33.36 5.49,36.61 | C1.2 7.53,50.62 8.48,51.57 | U$12.P$6 17.48,40.47 17.48,41.47 17.68,41.67 26.42,41.67 27.45,42.7 U$11.P$6 31.3,43.04 C19.2 37.13,43.44 v37.19,43.5 38.41,44.72 39.09,44.72 C15.2 41.19,44.8 C29.2 45.72,49.1 v45.72,53.25 | U$3.P$2 85.62,6.73 86.42,7.53 86.42,17.29 | 86.42,17.29 86.42,27.04 | 86.42,27.04 86.42,37 | 86.42,37 86.42,47.16 | 86.42,47.16 86.42,47.36 | 86.42,47.36 86.42,56.91 | 86.42,56.91 86.42,66.67 86.02,67.07 85.61,67.07 | 85.61,67.07 84.86,67.07 U$9.P$2 | U$8.P$2 86.35,56.84 86.42,56.91 | U$7.P$2 86.25,46.98 86.42,47.16 | U$6.P$2 86.39,37.03 86.42,37 | U$5.P$2 86.05,26.66 86.42,27.04 | U$4.P$2 86.25,17.11 86.42,17.29 | 85.61,67.07 86.22,67.68 86.22,75.2 84.99,76.43 U$10.P$2 84.8,76.74 v84.8,78.45 84.8,78.86 83.38,80.28 82.36,80.28 81.75,79.67 81.75,78.45 v81.95,78.25 | v29.46,25.01 28.27,26.2 IC1.7 IC1.2 | IC1.2 IC1.1 19.91,24.86 19.91,23.79 20.73,22.98 C13.1 22.11,22.57 18.9,22.57 17.27,24.2 17.27,25.62 15.85,27.04 TP2.TP | IC1.2 IC1.3 IC1.4 | LED9.A 78.5,43.65 78.5,41.67 77.23,40.4 LASER.3 v67.67,40.4 66.7,40.4 64.14,37.85 R30.1 Q3.2 | v82.77,49.9 85.31,47.36 86.42,47.36 | 43.59,34.36 41.15,31.92 C6.2 38.77,31.93 C28.2 35.06,31.93 v34.75,31.61 | C24.2 47.94,41.24 49.99,41.24 C5.2 53.21,41.24 v53.95,41.98
  Bottom 0.61: C15.2 39.17,56.46 41.45,58.74 v43.89,58.74 | C24.2 47.46,40.76 v45.72,40.76 43.89,38.93 v43.89,34.66 | v45.72,45.33 41.95,45.33 C29.2 | U$7.P$2 85.34,47.54 85.34,51.12 83.82,52.65 78.64,52.65 v77.42,53.86
  Bottom 0.813: 22.31,67.09 C9.2 | C9.2 C10.2 21.43,69.84 C11.2 | C12.2 21.43,67.96 C9.2 | 22.31,62.6 18.09,62.6 14.33,66.36 10.97,66.36 8.69,68.64 JP1.1 | UART.4 45.6,69.83 43.59,71.85 24.88,71.85
  Bottom 1.016: v11.04,49.38 10.33,50.09 9.96,50.09 8.48,51.57 6.91,53.14 6.91,61.79 6.91,66.26 6.29,66.87 JP1.1 | 22.31,62.6 IC2.2 22.31,67.09 | 22.31,62.6 27.84,62.6 27.84,52.03 16.87,52.03 16.87,62.6 22.31,62.6
  Bottom 1.27: 10.43,49.99 v11.04,49.38
  other vias: 10.13,42.47 4.54,47.96 12.67,49.38 27.43,68.49 8.33,70.12 8.33,67.28 11.04,51.01 12.67,51.01 9.96,70.12 9.96,67.28 16.46,16.78 7.72,23.79 82.97,13.83 81.55,61.18 27.64,16.68 82.16,70.53 21.74,34.15 13.21,33.34 22.35,51.32 82.77,33.54 38,17.49 17.68,27.85 34.14,16.78 15.65,10.18 14.63,10.18 13.61,10.18 12.6,10.18 11.58,10.18 10.57,10.18 9.55,10.18 19.3,22.77 21.84,16.68 21.74,13.33 8.53,37.2 17.88,32.32 15.54,63.01 28.96,63.31 15.54,61.48 28.96,61.79 15.54,59.96 28.96,60.26 22.86,71.54 20.83,51.32 23.88,51.32 25.4,51.32 19.3,51.32 28.96,58.74 28.96,57.22 28.96,55.69 28.96,54.17 28.96,52.34 43.89,59.96 43.89,57.52 14.19,49.38 16.76,68.49 21.64,71.54 20.42,71.54 38.4,58.74 38.4,57.52 34.75,68.49 38.4,59.96 78.03,55.08 53.64,29.78 44.2,27.65 71.93,40.71 79.55,34 59.13,51.68 41.15,46.8 28.65,30.95 28.35,38.88 32.92,52.9 31.6,20.95 32.61,40.4 39.93,28.26 53.04,36.8
  pour Top: -4.88,88 92.66,88 92.66,-5.88 -4.88,-5.88
  pour Bottom: -7.01,98.06 89.31,98.06 89.31,-14.72 -7.01,-14.72
IR_LED_CONTROLL  (via drill 0.45)
  Top 0.254: U2.2 46.63,31.34 46.63,28.57 51.51,23.69 53.65,23.69 61.57,31.61 v61.57,34.36
  Bottom 0.254: R30.2 62.08,34.87 v61.57,34.36
  Bottom 0.305: Q3.1 R30.2
IR_LED_FRONT  (via drill 0.45)
  Top 0.406: LED10.K 79.03,39.23 v72.24,39.23
  Bottom 0.305: IR_RIGHT.K 51.51,57.43 51.51,55.39 53.03,53.86 53.03,50.21
  Bottom 0.406: v72.24,39.23 69.9,36.9 Q3.3 66.33,34.85 66.14,34.66 63.7,34.66 61.87,32.83 | 61.87,32.83 59.74,32.83 58.22,34.36 58.22,42.59 53.03,47.77 53.03,53.86 | IR_LEFT.K 51.91,25.91 53.95,27.96 57,27.96 61.87,32.83
KEY  (via drill 0.6)
  Top 0.254: USER.3 3.07,28.28 v4.06,29.28 | v16.66,34.56 17.07,34.56 20.12,37.61 33.98,37.61 U2.80
  Bottom 0.254: v4.06,29.28 7.92,29.28 8.74,30.09 12.19,30.09 v16.66,34.56
LED_1
  Top 0.254: R28.2 14.94,31.21 20.73,37 34.06,37 U2.81
LEFT_ENC_A
  Top 0.254: U$11.P$4 23.45,46.02 26.01,48.58 31.9,48.58 33.22,49.9 36.58,49.9 37.19,49.29 37.19,48.58 U2.63
LEFT_ENC_B
  Top 0.254: U$11.P$5 25.45,46.8 26.42,47.77 32,47.77 33.53,49.29 36.27,49.29 36.58,48.99 36.58,48.47 U2.64
LINE_LED  (via drill 0.45, 0.6)
  Top 0.254: v85.31,52.54 86.42,52.54
  Top 0.406: v85.2,13.22 85.61,13.22 86.42,14.04 86.42,22.57 | 86.42,22.57 86.42,32.93 | 86.42,32.93 86.42,42.59 | 86.42,42.59 86.42,52.54 86.42,61.59 | 86.42,61.59 86.42,70.73 85.81,71.34 v85.2,71.34 | v85.31,61.38 86.22,61.38 86.42,61.59 | v85.41,32.93 86.42,32.93 | v85.31,22.57 86.42,22.57 | v81.38,41.98 78.64,41.98 78.03,42.59 78.03,47.46 77.72,47.77 74.37,47.77 v74.07,47.46 | v85.34,42.28 85.65,42.59 86.42,42.59
  Bottom 0.254: LED3.C 85.1,30.09
  Bottom 0.305: Q2.3 69.8,49.02
  Bottom 0.406: v85.31,61.38 85,61.69 LED7.C | v85.41,32.93 85.1,32.62 85.1,30.09 LED3.C | v85.31,22.57 85.1,22.36 LED2.C | v85.2,71.34 85.2,73.49 85.41,73.69 LED8.C 84.87,73.98 83.78,73.98 83.17,74.59 83.17,78.86 v82.77,79.26 | 84.89,43.41 LED5.C 84.89,42.73 v85.34,42.28 | v85.2,13.22 85.12,13.14 LED1.C | v74.07,47.46 72.51,49.02 69.8,49.02 | LED4.C 84.89,41.83 v85.34,42.28 | v81.38,41.98 81.69,42.28 v85.34,42.28
  Bottom 0.61: v85.31,52.54 85.12,52.73 85.12,53.86 LED6.C
LINE_LED_CONTROLL  (via drill 0.45, 0.61)
  Top 0.254: U2.44 48.16,50.38 48.16,51.12 v47.85,51.43 | v71.93,46.85 69.8,46.85 68.89,47.77 65.23,47.77 v64.92,47.46
  Bottom 0.254: v47.85,51.43 47.85,52.03 49.68,53.86 49.68,58.44 50.6,59.35 53.03,59.35 v64.92,47.46 | Q2.1 71.9,46.82 v71.93,46.85
  Bottom 0.305: R3.2 Q2.1
M1  (via drill 0.6, 0.61)
  Top 0.254: IO1.14 5.83,45.4 5.66,45.57 5.66,46.59 6.17,47.1 6.17,48.06 v6.27,48.16 | v25.3,32.83 37.69,32.83 U2.92
  Bottom 0.254: v6.27,48.16 11.59,48.16 12.8,46.95 12.8,41.47 22.15,32.12 24.59,32.12 v25.3,32.83
N$1
  Top 0.406: IO1.6 15.17,42.15 15.65,41.67 15.65,40.05 16.87,38.83 23.83,38.83 U$12.P$2
N$2
  Top 0.406: IO1.4 14.64,40.85 15.06,40.43 15.06,39.8 16.65,38.22 26.01,38.22 27.45,39.66 U$12.P$1
N$3
  Top 0.406: IO1.7 17.21,42.8 U$11.P$1
N$4
  Top 0.406: IO1.9 16.24,44.1 16.87,44.72 19.1,44.72 19.51,44.31 19.51,43.1 U$11.P$2
N$5
  Top 0.254: IO1.17 6,43.45 5.66,43.79 5.66,44.05 5.15,44.56 4.64,44.56 4.39,44.81 4.39,45.6 C3.2
N$6
  Top 0.254: 36.47,22.88 LSM6DS0.P$14 36.77,22.88 36.88,22.77 36.88,22.2 C14.2
N$7
  Top 0.406: R29.1 78.32,35.98 LED10.A
N$8
  Top 0.305: IO1.24 IO1.23 IO1.22
N$9
  Top 0.406: R1.2 13.56,38.72 IO1.1
N$13
  Top 0.406: R33.1 59.44,32.35 59.44,30.7 54.74,26 IR_LEFT.A
N$14  (via drill 0.6)
  Top 0.254: v82.36,12.01 82.36,9.7 R5.1
  Bottom 0.254: LED1.A 81.62,11.27 v82.36,12.01
N$15  (via drill 0.6)
  Top 0.406: R10.1 82.51,20.8 v81.34,21.96
  Bottom 0.406: v81.34,21.96 81.34,20.31 LED2.A
N$16  (via drill 0.6)
  Top 0.254: R12.1 82.3,31.57 v81.55,32.33
  Bottom 0.254: v81.55,32.33 81.55,30.06 LED3.A
N$17  (via drill 0.6)
  Top 0.254: R17.1 82.3,39.9 v81.34,40.86
  Bottom 0.254: 81.75,39.92 LED4.A 81.39,40.81 v81.34,40.86
N$18  (via drill 0.6)
  Top 0.254: R19.1 81.52,44.49 v79.92,42.89
  Bottom 0.254: LED5.A 81.39,44.36 v79.92,42.89
N$19  (via drill 0.6)
  Top 0.254: 82.36,53.88 R21.1 82.13,53.76 v81.04,53.76
  Bottom 0.254: LED6.A 81.26,53.99 v81.04,53.76
N$20  (via drill 0.6)
  Top 0.254: v82.77,62.2 82.77,63.84 R23.1
  Bottom 0.254: LED7.A 81.5,63.47 v82.77,62.2
N$21  (via drill 0.6)
  Top 0.254: R25.1 81.9,72.62 v82.56,71.95
  Bottom 0.254: v82.56,71.95 82.56,73.04 LED8.A
N$22
  Top 0.254: IO1.20 5.16,41.5 C4.2
N$23
  Top 0.406: LED12.A 3.28,18.59 R27.2
N$24
  Top 0.406: R31.1 54.25,56.59 IR_RIGHT.A
N$25  (via drill 0.61)
  Top 0.254: U2.73 33.53,45.16 v33.53,45.33
  Bottom 0.254: v33.53,45.33 31.71,45.33 C19.1
N$26  (via drill 0.35)
  Top 0.254: v15.44,2.25 14.82,2.25 14.51,2.57 14.4,2.57
  Top 0.305: LASER1.4 16.61,6.88 U1.11 14.62,4.89 v15.44,4.89
  Top 0.406: U1.1 14.51,2.57
  Bottom 0.305: R35.2 8.74,5.3 9.14,5.71 14.63,5.71 14.73,5.6 | 14.73,5.6 v15.44,4.89 v15.44,2.25 | 14.73,5.6 14.73,5.44 C17.2 C18.2
N$27
  Top 0.305: U1.9 12.8,5.3 12.6,5.5 10.57,5.5 8.99,7.08 LASER1.1
N$28
  Top 0.305: U1.10 13.6,5.51 13.01,6.11 11.99,6.11 11.58,6.52 11.58,7.69 LASER1.2
N$29  (via drill 0.35)
  Top 0.305: U1.5 11.19,2.66 v9.55,2.66
  Bottom 0.305: v9.55,2.66 9.41,2.52 R35.1
N$30
  Top 0.254: U2.48 47.28,52.34 48.77,52.34 49.22,52.79 C23.2
N$33  (via drill 0.6)
  Top 0.254: v7.72,16.68 6.5,16.68 LED11.A | v11.99,27.65 12.78,28.45 R28.1
  Bottom 0.254: v11.99,27.65 7.92,27.65 5.89,25.62 5.89,18.51 v7.72,16.68
N$55  (via drill 0.6)
  Top 0.254: R7.1 11.8,60.51 12.96,61.68 12.96,63.17 v13.21,63.41
  Top 0.406: X1.2 11.24,59.11 R7.1
  Bottom 0.254: v13.21,63.41 13.21,61.92 C20.2
N$56  (via drill 0.6)
  Top 0.254: v14.63,55.49 12.19,55.49 11.79,55.9 11.79,57.69 R8.1
  Top 0.406: X1.3 11.17,58.31 R8.1
  Bottom 0.254: C16.1 14.32,55.8 v14.63,55.49
N$57  (via drill 0.6)
  Top 0.406: X1.1 8.61,60.04 9.75,61.18 10.57,61.18 11.79,62.4 v11.79,64.43
  Bottom 0.406: v11.79,64.43 9.04,64.43 D1.A
OSCIN
  Top 0.254: U2.12 49.99,35.06 49.99,31.31 49.35,30.68 | Q1.3 49.36,30.67 49.35,30.68 | 49.35,30.68 C22.1
OSCOUT
  Top 0.254: C21.1 55.46,34.98 | 55.46,34.98 54.84,34.36 51.41,34.36 U2.13 | Q1.1 55.46,33.35 55.46,34.98
RESET  (via drill 0.6, 0.61)
  Top 0.254: C25.2 25.86,24.25 v27.53,22.57 | v40.84,23.38 v40.84,26.74 | U2.14 51.21,35.27 v52.43,35.27
  Top 0.406: RESET.3 RESET.4 10.18,21.78 10.97,22.57 12.09,22.57 R15.1 12.2,24.25 C25.2
  Bottom 0.254: v27.53,22.57 30.89,22.57 32.92,24.6 39.62,24.6 v40.84,23.38 | v40.84,26.74 49.38,35.27 v52.43,35.27
RIGHT_ENC_A  (via drill 0.6)
  Top 0.254: v24.59,35.37 27.74,35.37 28.96,34.15 37.57,34.15 U2.90
  Bottom 0.254: U$12.P$4 21.45,38.51 v24.59,35.37
RIGHT_ENC_B  (via drill 0.6)
  Top 0.254: v23.98,33.75 28.35,33.75 28.65,33.44 37.58,33.44 U2.91
  Bottom 0.254: U$12.P$5 19.45,38.28 v23.98,33.75
SCL  (via drill 0.45, 0.6, 0.61)
  Top 0.254: 34.64,25.73 LSM6DS0.P$2 34.64,26.74 v35.76,26.74 38.04,26.74 R14.1 | v34.75,35.27 34.75,36.25 U2.83 38.64,40.15 42.67,40.15 44.5,38.32 v45.41,38.32 | v56.69,41.37 58.58,43.25 X2.8 75.75,43.25 LASER.2
  Bottom 0.254: 34.44,26.74 v35.76,26.74 34.14,26.74 32.61,28.26 | TP3.TP 16.05,28.87 16.87,29.68 21.13,29.68 23.37,27.45 26.47,27.45 IC1.6 31.83,27.47 32.61,28.26 | 32.61,28.26 32.61,33.44 34.44,35.27 v34.75,35.27 | v56.69,41.37 53.65,38.32 v45.41,38.32
SDA  (via drill 0.45, 0.61)
  Top 0.254: R13.1 33.23,28.06 | R13.1 33.57,28.87 33.37,29.07 29.46,29.07 v28.96,28.57 | 34.14,25.21 LSM6DS0.P$3 34.14,27.83 R13.1 | v33.22,35.27 33.22,35.45 U2.82 38.53,40.76 43.89,40.76 45.41,39.23 v46.33,39.23 | v55.78,41.98 57.55,43.75 X2.9 73.71,43.75 75.44,45.48 LASER.1
  Bottom 0.254: TP4.TP 15.44,30.5 22.15,30.5 23.9,28.74 IC1.5 28.78,28.74 v28.96,28.57 31.7,31.31 31.7,33.75 v33.22,35.27 | v55.78,41.98 53.03,39.23 v46.33,39.23
UART_RX  (via drill 0.61)
  Top 0.254: U2.69 34.14,47.39 v34.14,48.07 | v39.93,64.23 40.52,64.82 UART.2
  Bottom 0.305: v34.14,48.07 34.14,60.27 37.19,63.31 39.62,63.31 39.93,63.62 v39.93,64.23
UART_TX  (via drill 0.61)
  Top 0.254: U2.68 35.36,46.89 v35.36,48.38 | v41.76,63.92 43.06,65.23 UART.3
  Bottom 0.305: v35.36,48.38 35.36,59.96 37.8,62.4 40.23,62.4 v41.76,63.92
USBDM  (via drill 0.6)
  Top 0.254: R7.2 13.91,59.66 16.26,57.32 16.26,52.44 19.71,48.99 v20.93,48.99 | 27.59,46.55 v27.43,46.55 28.96,46.55 29.57,47.16 33.65,47.16 U2.70
  Bottom 0.254: v20.93,48.99 24.99,48.99 v27.43,46.55
USBDP  (via drill 0.6)
  Top 0.254: R8.2 14.62,57.73 15.65,56.71 15.65,54.68 | 15.65,54.68 14.83,53.86 13.13,53.86 R9.2 | 15.65,54.68 15.65,52.03 v19.91,47.77 | U2.71 33.88,46.24 29.87,46.24 28.65,45.02 27.13,45.02 v27.03,45.13
  Bottom 0.254: v19.91,47.77 24.38,47.77 v27.03,45.13
VCC  (via drill 0.45, 0.6, 0.61)
  Top 0.254: C7.+ 3.25,50.09 2.81,50.09 2.71,49.99
  Top 0.305: 4.13,42.8 C3.1
  Top 0.406: IO1.18 4.39,42.8 C3.1 5.04,42.15 IO1.19 | R1.1 9.95,35.36 8.74,34.15 4.06,34.15 3.66,34.56 3.66,36.01 C2.1 3.22,36.02 2.86,35.67 | v2.03,51.63 2.03,51.31 3.25,50.09 | v31.7,63.92 28.65,66.97 19.81,66.97 18.59,68.19 18.59,70.02 17.07,71.54 4.57,71.54 3.86,70.83 3.86,68.54 | R33.2 59.74,34.55 v59.74,35.58 62.18,35.58 v64.31,33.44 | v56.39,53.86 56.15,54.1 R31.2 56.15,56.54 52.73,59.96 51.82,59.96 50.9,60.87 v50.9,61.18 | R29.2 70.11,35.88 v68.58,35.88
  Top 0.61: 2.71,49.99 2.71,49.48
  Top 1.016: C7.+ 3.86,50.62 5.08,51.83 5.08,55.08 4.06,56.1 4.06,60.57 5.28,61.79 5.28,64.84 3.86,66.26 3.86,68.54 JP1.2
  Top 1.27: 4.01,42.88 C3.1 3.9,43.03 2.61,43.03 2.35,43.29 | 2.35,43.29 2.35,49.13 2.71,49.48 | 2.86,35.67 2.35,36.17 2.35,43.29
  Bottom 0.406: C1.1 3.14,50.52 v2.03,51.63 | v50.9,61.18 50.6,61.48 50.6,62.7 47.24,66.06 38.41,66.06 36.27,63.92 v31.7,63.92 | v68.58,35.88 66.14,33.44 v64.31,33.44 | v59.74,35.58 59.74,36.19 58.83,37.1 58.83,43.2 53.95,48.07 53.95,52.65 55.17,53.86 v56.39,53.86
  Bottom 0.813: IC2.1 19.77,67.93 C9.1 C10.1 19.58,70.56 18.61,71.53 4.61,71.53 3.75,70.67 JP1.2
  Bottom 1.016: D1.C 3.76,64.53 2.64,65.65 2.64,67.53 3.23,68.11 | 3.23,68.11 JP1.2 | 3.05,68.29 3.23,68.11

### Text on the board
tNames: + | + | R | T | UART